# Altium schematic sheet DC-DC SY8120B1.SchDoc
size A2
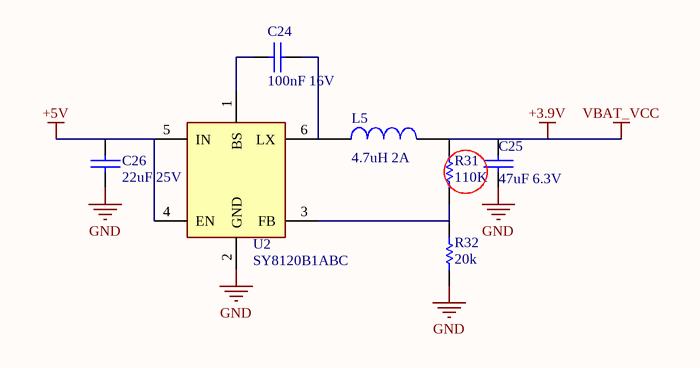
[diagram p0: DC-DC SY8120B1.SchDoc]

## Parts
C24  100nF 16V  [0402C]
C25  47uF 6.3V  [0805C]
C26  22uF 25V  [0805C]
L5  4.7uH 2A  [CD32]
R31  110K  [0402R]
R32  20k  [0402R]
U2  SY8120B1ABC  [SOT23-6]

## Nets
+3.9V: C25.2 L5.2 R31.2  [also labelled VBAT_VCC]
+5V: C26.2 U2.4(EN) U2.5(IN)
GND: C25.1 C26.1 R32.1 U2.2(GND)
NetC24_1: C24.1 L5.1 U2.6(LX)
NetC24_2: C24.2 U2.1(BS)
NetR31_1: R31.1 R32.2 U2.3(FB)

## Library data of the parts
C24 C25 = CAP-NP
C26 = CAP-NP: 22uF (226) ±20% 25V X5R
L5 = INDUCTOR
R31 R32 = RES
U2 = SY8120B1ABC: 可输出电流 2A / 输出电压（最小值/固定） 0.6V / 输出电压（最大值） 18V / 开关工作频率 500kHz / 输出类型 Adjustable / 输出电压的路数 1 / 最小输入电压 4.5V / 最大输入电压 18V / 电源拓扑结构 Buck / 同步整流与否 Yes / 功能类型 Step-Down / 输出配置 Positive; Manufacturer_Name: Silergy; Manufacturer_Part_Number: SY8088AAC; Datasheet Link: https://lcsc.com/product-detail/DC-DC-Converters_Silergy_SY8088AAC_SY8088AAC_C79313.html; Height: 1.4mm; ComponentLink1Description: LCSC; ComponentLink1URL: https://item.szlcsc.com/208856.html